# EAGLE schematic InputBoard (EAGLE 7.1.0)
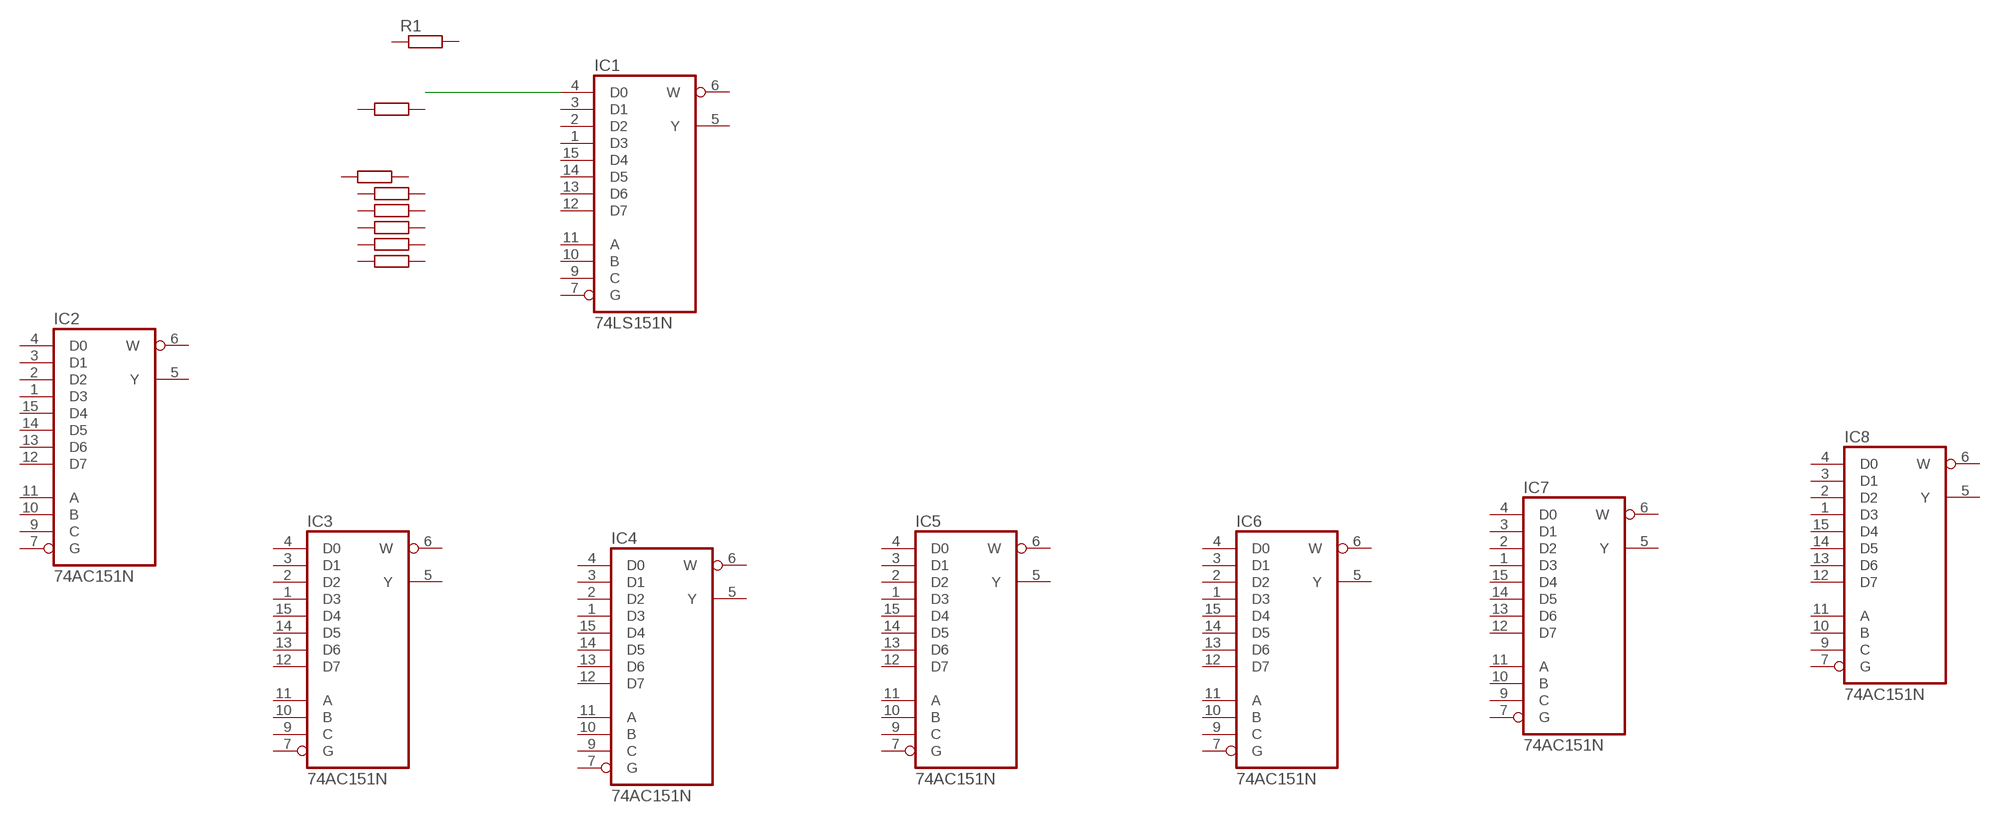
[diagram p0: schematic, sheet 1]

## Parts
IC1  74LS151N  [DIL16]
IC2  74AC151N  [DIL16]
IC3  74AC151N  [DIL16]
IC4  74AC151N  [DIL16]
IC5  74AC151N  [DIL16]
IC6  74AC151N  [DIL16]
IC7  74AC151N  [DIL16]
IC8  74AC151N  [DIL16]
R1  R-EU_0207/10  [0207/10]

## Nets
N$1: IC1.4(D0)
Unconnected: IC1.1(D3) IC1.2(D2) IC1.3(D1) IC1.5(Y) IC1.6(W) IC1.7(G) IC1.9(C) IC1.10(B) IC1.11(A) IC1.12(D7) IC1.13(D6) IC1.14(D5) IC1.15(D4) IC2.1(D3) IC2.2(D2) IC2.3(D1) IC2.4(D0) IC2.5(Y) IC2.6(W) IC2.7(G) IC2.9(C) IC2.10(B) IC2.11(A) IC2.12(D7) IC2.13(D6) IC2.14(D5) IC2.15(D4) IC3.1(D3) IC3.2(D2) IC3.3(D1) IC3.4(D0) IC3.5(Y) IC3.6(W) IC3.7(G) IC3.9(C) IC3.10(B) IC3.11(A) IC3.12(D7) IC3.13(D6) IC3.14(D5) IC3.15(D4) IC4.1(D3) IC4.2(D2) IC4.3(D1) IC4.4(D0) IC4.5(Y) IC4.6(W) IC4.7(G) IC4.9(C) IC4.10(B) IC4.11(A) IC4.12(D7) IC4.13(D6) IC4.14(D5) IC4.15(D4) IC5.1(D3) IC5.2(D2) IC5.3(D1) IC5.4(D0) IC5.5(Y) IC5.6(W) IC5.7(G) IC5.9(C) IC5.10(B) IC5.11(A) IC5.12(D7) IC5.13(D6) IC5.14(D5) IC5.15(D4) IC6.1(D3) IC6.2(D2) IC6.3(D1) IC6.4(D0) IC6.5(Y) IC6.6(W) IC6.7(G) IC6.9(C) IC6.10(B) IC6.11(A) IC6.12(D7) IC6.13(D6) IC6.14(D5) IC6.15(D4) IC7.1(D3) IC7.2(D2) IC7.3(D1) IC7.4(D0) IC7.5(Y) IC7.6(W) IC7.7(G) IC7.9(C) IC7.10(B) IC7.11(A) IC7.12(D7) IC7.13(D6) IC7.14(D5) IC7.15(D4) IC8.1(D3) IC8.2(D2) IC8.3(D1) IC8.4(D0) IC8.5(Y) IC8.6(W) IC8.7(G) IC8.9(C) IC8.10(B) IC8.11(A) IC8.12(D7) IC8.13(D6) IC8.14(D5) IC8.15(D4) R1.1 R1.2

## Power pins joined to a net without a drawn wire
GND: IC1.8(GND) IC2.8(GND) IC3.8(GND) IC4.8(GND) IC5.8(GND) IC6.8(GND) IC7.8(GND) IC8.8(GND)
VCC: IC1.16(VCC) IC2.16(VCC) IC3.16(VCC) IC4.16(VCC) IC5.16(VCC) IC6.16(VCC) IC7.16(VCC) IC8.16(VCC)

## Library data of the parts
IC1-IC8 = 74xx-eu:74*151: Data SELECTOR/MULTIPLEXER
R1 = rcl:R-EU_: RESISTOR, European symbol